# EAGLE design board2 (EAGLE 7.6.0)
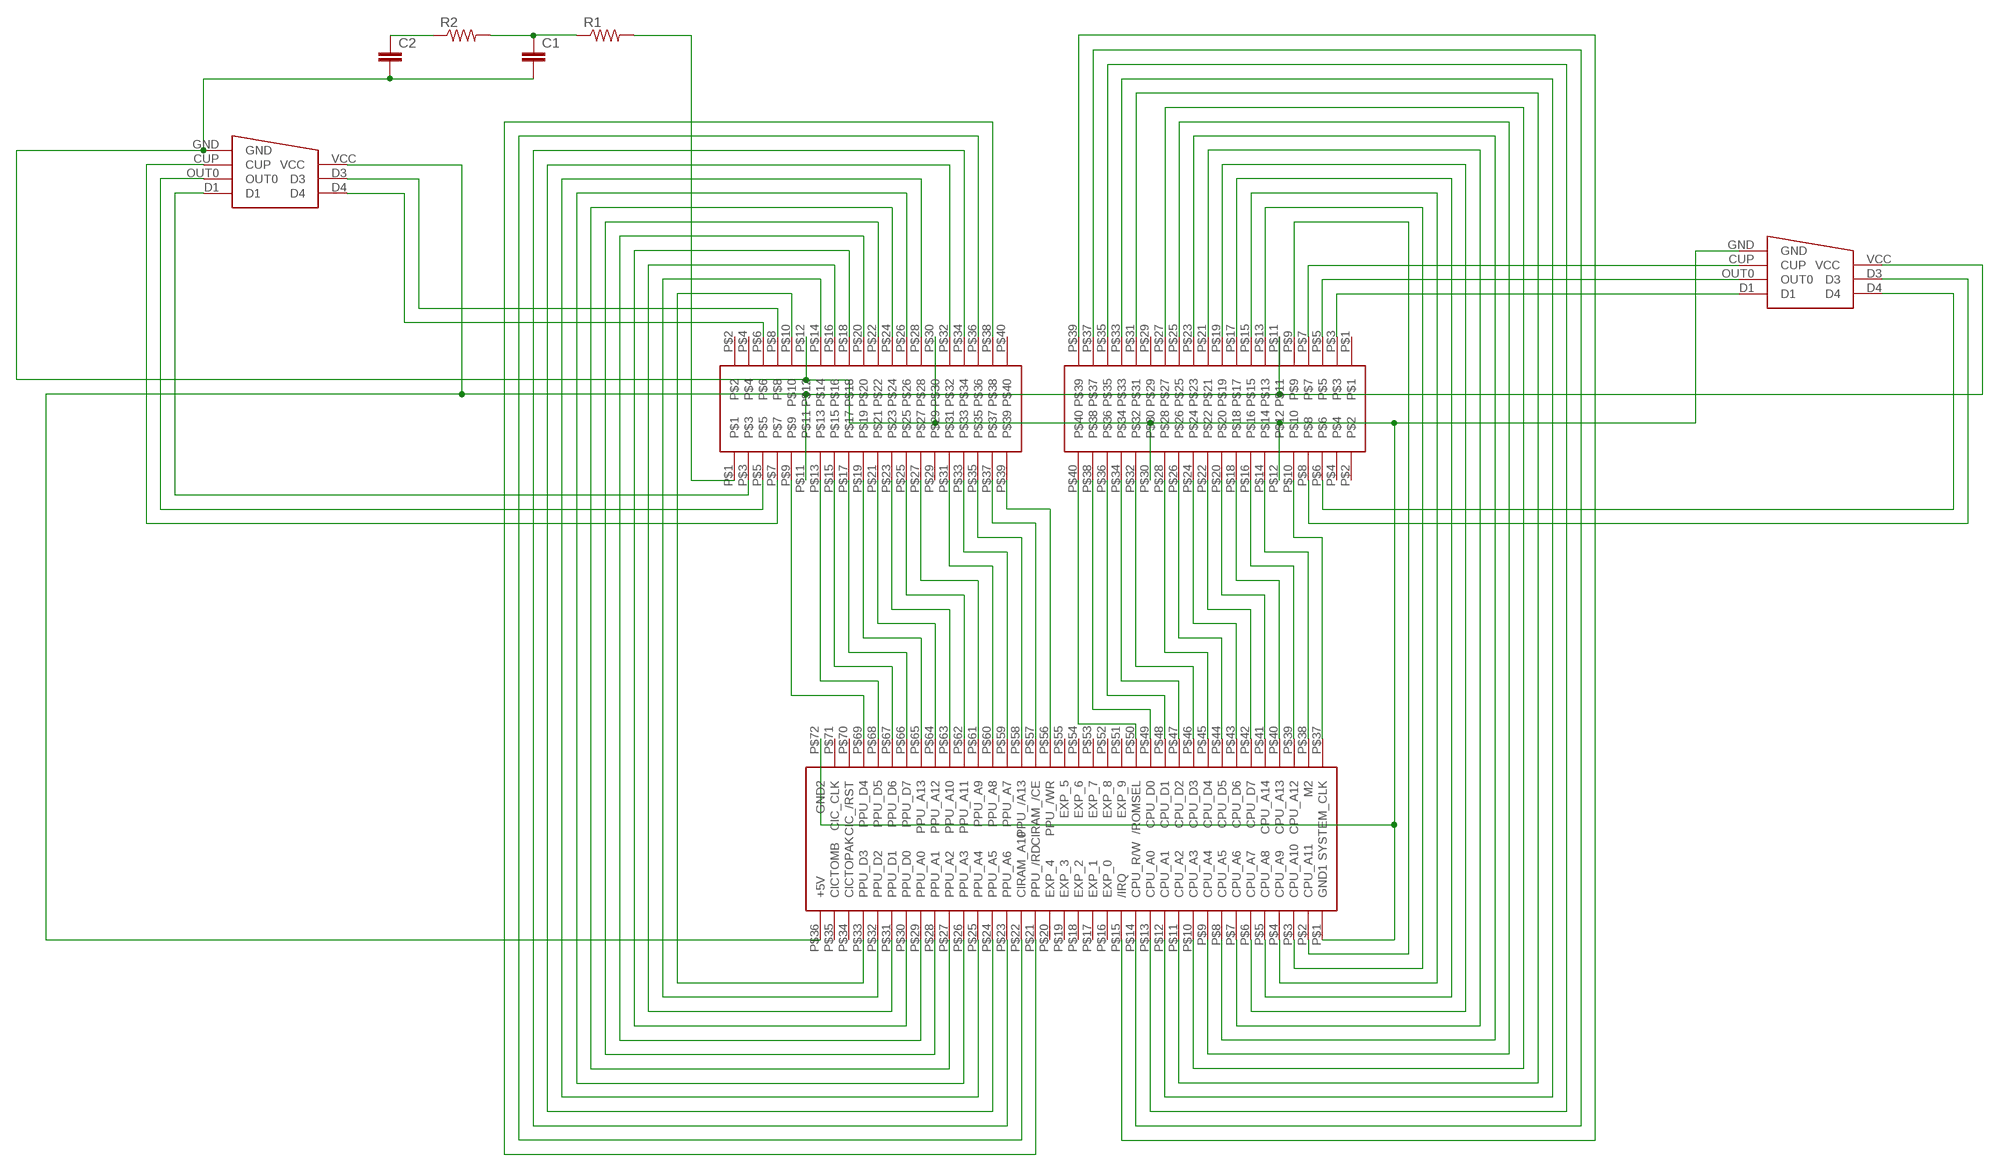
[diagram p0: schematic, sheet 1]

## Parts
C1  C5/2.5  [C5B2.5]
C2  C5/2.5  [C5B2.5]
R1  R-US_0207/12  [0207/12]
R2  R-US_0207/12  [0207/12]
U$1  NES_CONN  [36X2]
U$2  40PINNER  [40PINNER]
U$3  40PINNER  [40PINNER]
U$4  7CONN  [7CON]
U$5  7CONN  [7CON]

## Nets
+5V: U$1.P$36(+5V) U$2.P$11 U$3.P$11 U$4.VCC U$5.VCC
AUD: C2.1 R2.1
GND: C1.2 C2.2 U$1.P$1(GND1) U$1.P$72(GND2) U$2.P$12 U$2.P$30 U$3.P$12 U$3.P$30 U$4.GND U$5.GND
N$1: U$3.P$7 U$4.CUP
N$2: U$1.P$2(CPU_A11) U$3.P$9
N$3: U$1.P$50(/ROMSEL) U$3.P$40
N$4: U$1.P$49(CPU_D0) U$3.P$38
N$5: U$1.P$3(CPU_A10) U$3.P$13
N$6: U$1.P$4(CPU_A9) U$3.P$15
N$7: U$1.P$48(CPU_D1) U$3.P$36
N$8: U$1.P$47(CPU_D2) U$3.P$34
N$9: U$1.P$46(CPU_D3) U$3.P$32
N$10: U$1.P$5(CPU_A8) U$3.P$17
N$11: U$1.P$6(CPU_A7) U$3.P$19
N$12: U$3.P$8 U$4.D3
N$13: U$1.P$45(CPU_D4) U$3.P$28
N$14: U$1.P$44(CPU_D5) U$3.P$26
N$15: U$1.P$43(CPU_D6) U$3.P$24
N$16: U$1.P$42(CPU_D7) U$3.P$22
N$17: U$1.P$41(CPU_A14) U$3.P$20
N$18: U$1.P$40(CPU_A13) U$3.P$18
N$19: U$1.P$39(CPU_A12) U$3.P$16
N$20: U$1.P$38(M2) U$3.P$14
N$21: U$1.P$37(SYSTEM_CLK) U$3.P$10
N$22: U$3.P$5 U$4.OUT0
N$23: U$1.P$7(CPU_A6) U$3.P$21
N$24: U$1.P$8(CPU_A5) U$3.P$23
N$25: U$1.P$9(CPU_A4) U$3.P$25
N$26: U$1.P$10(CPU_A3) U$3.P$27
N$27: U$1.P$11(CPU_A2) U$3.P$31
N$28: U$1.P$12(CPU_A1) U$3.P$33
N$29: U$1.P$13(CPU_A0) U$3.P$35
N$30: U$1.P$14(CPU_R/W) U$3.P$37
N$31: U$1.P$15(/IRQ) U$3.P$39
N$32: U$3.P$6 U$4.D4
N$33: U$1.P$69(PPU_D4) U$2.P$9
N$34: U$1.P$68(PPU_D5) U$2.P$13
N$35: U$1.P$67(PPU_D6) U$2.P$15
N$36: U$1.P$66(PPU_D7) U$2.P$17
N$37: U$1.P$65(PPU_A13) U$2.P$19
N$38: U$1.P$64(PPU_A12) U$2.P$21
N$39: U$1.P$63(PPU_A10) U$2.P$23
N$40: U$1.P$62(PPU_A11) U$2.P$25
N$41: U$1.P$61(PPU_A9) U$2.P$27
N$42: U$1.P$60(PPU_A8) U$2.P$31
N$43: U$1.P$59(PPU_A7) U$2.P$33
N$44: U$1.P$58(PPU_/A13) U$2.P$35
N$45: U$1.P$57(CIRAM_/CE) U$2.P$37
N$46: U$1.P$56(PPU_/WR) U$2.P$39
N$47: U$3.P$3 U$4.D1
N$48: U$2.P$8 U$5.D3
N$49: U$1.P$33(PPU_D3) U$2.P$10
N$50: U$1.P$32(PPU_D2) U$2.P$14
N$51: U$1.P$31(PPU_D1) U$2.P$16
N$52: U$1.P$30(PPU_D0) U$2.P$18
N$53: U$1.P$29(PPU_A0) U$2.P$20
N$54: U$1.P$28(PPU_A1) U$2.P$22
N$55: U$1.P$27(PPU_A2) U$2.P$24
N$56: U$1.P$26(PPU_A3) U$2.P$26
N$57: U$1.P$25(PPU_A4) U$2.P$28
N$58: U$1.P$24(PPU_A5) U$2.P$32
N$59: U$1.P$23(PPU_A6) U$2.P$34
N$60: U$1.P$22(CIRAM_A10) U$2.P$36
N$61: U$1.P$21(PPU_/RD) U$2.P$38
N$62: U$2.P$6 U$5.D4
N$63: U$2.P$7 U$5.CUP
N$64: U$2.P$5 U$5.OUT0
N$65: U$2.P$3 U$5.D1
N$67: C1.1 R1.1 R2.2
N$68: R1.2 U$2.P$1
Unconnected: U$1.P$16(EXP_0) U$1.P$17(EXP_1) U$1.P$18(EXP_2) U$1.P$19(EXP_3) U$1.P$20(EXP_4) U$1.P$34(CICTOPAK) U$1.P$35(CICTOMB) U$1.P$51(EXP_9) U$1.P$52(EXP_8) U$1.P$53(EXP_7) U$1.P$54(EXP_6) U$1.P$55(EXP_5) U$1.P$70(CIC_/RST) U$1.P$71(CIC_CLK) U$2.P$2 U$2.P$4 U$2.P$29 U$2.P$40 U$3.P$1 U$3.P$2 U$3.P$4 U$3.P$29

## Library data of the parts
C1 C2 = capacitor-wima:C: CAPACITOR naming: grid - package width
R1 R2 = rcl:R-US_: RESISTOR, American symbol
U$1 = NES:NES_CONN: NES
U$2 U$3 = NES:40PINNER
U$4 U$5 = NES:7CONN

## Board
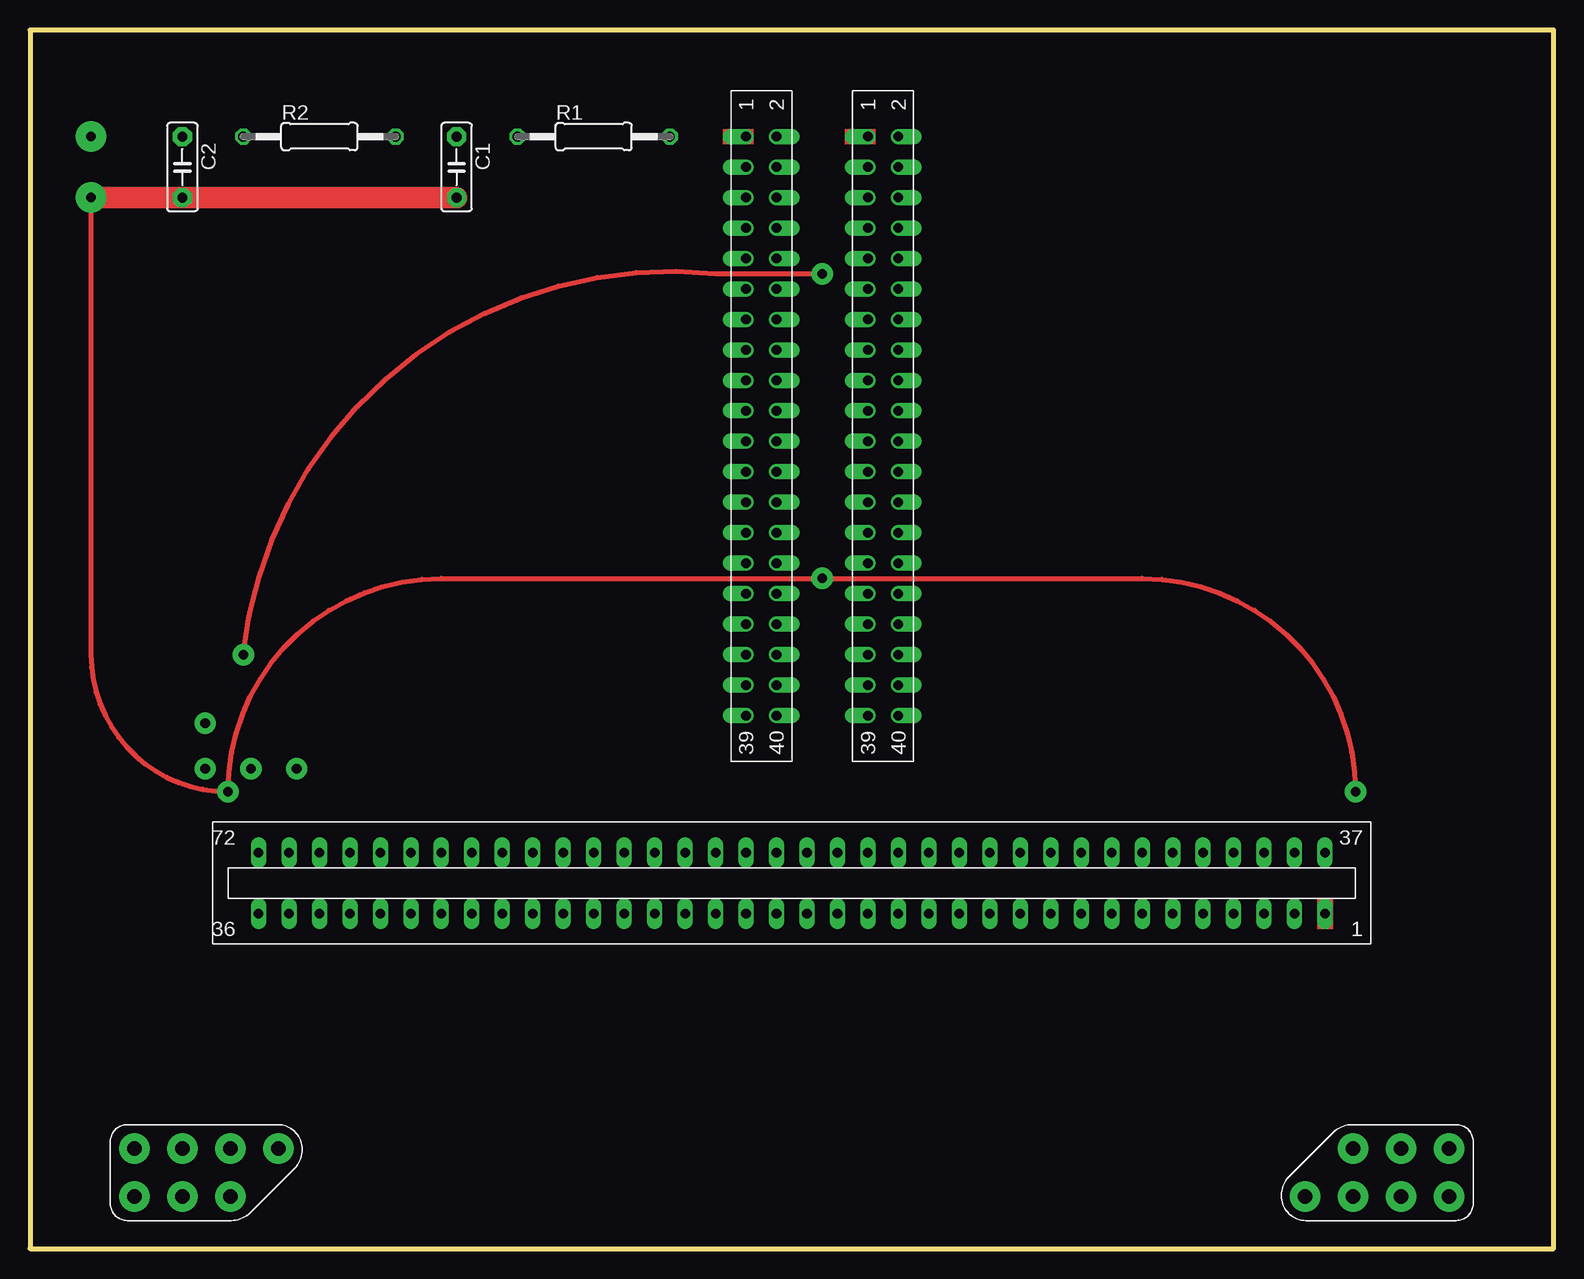
[diagram p1: board, top side]
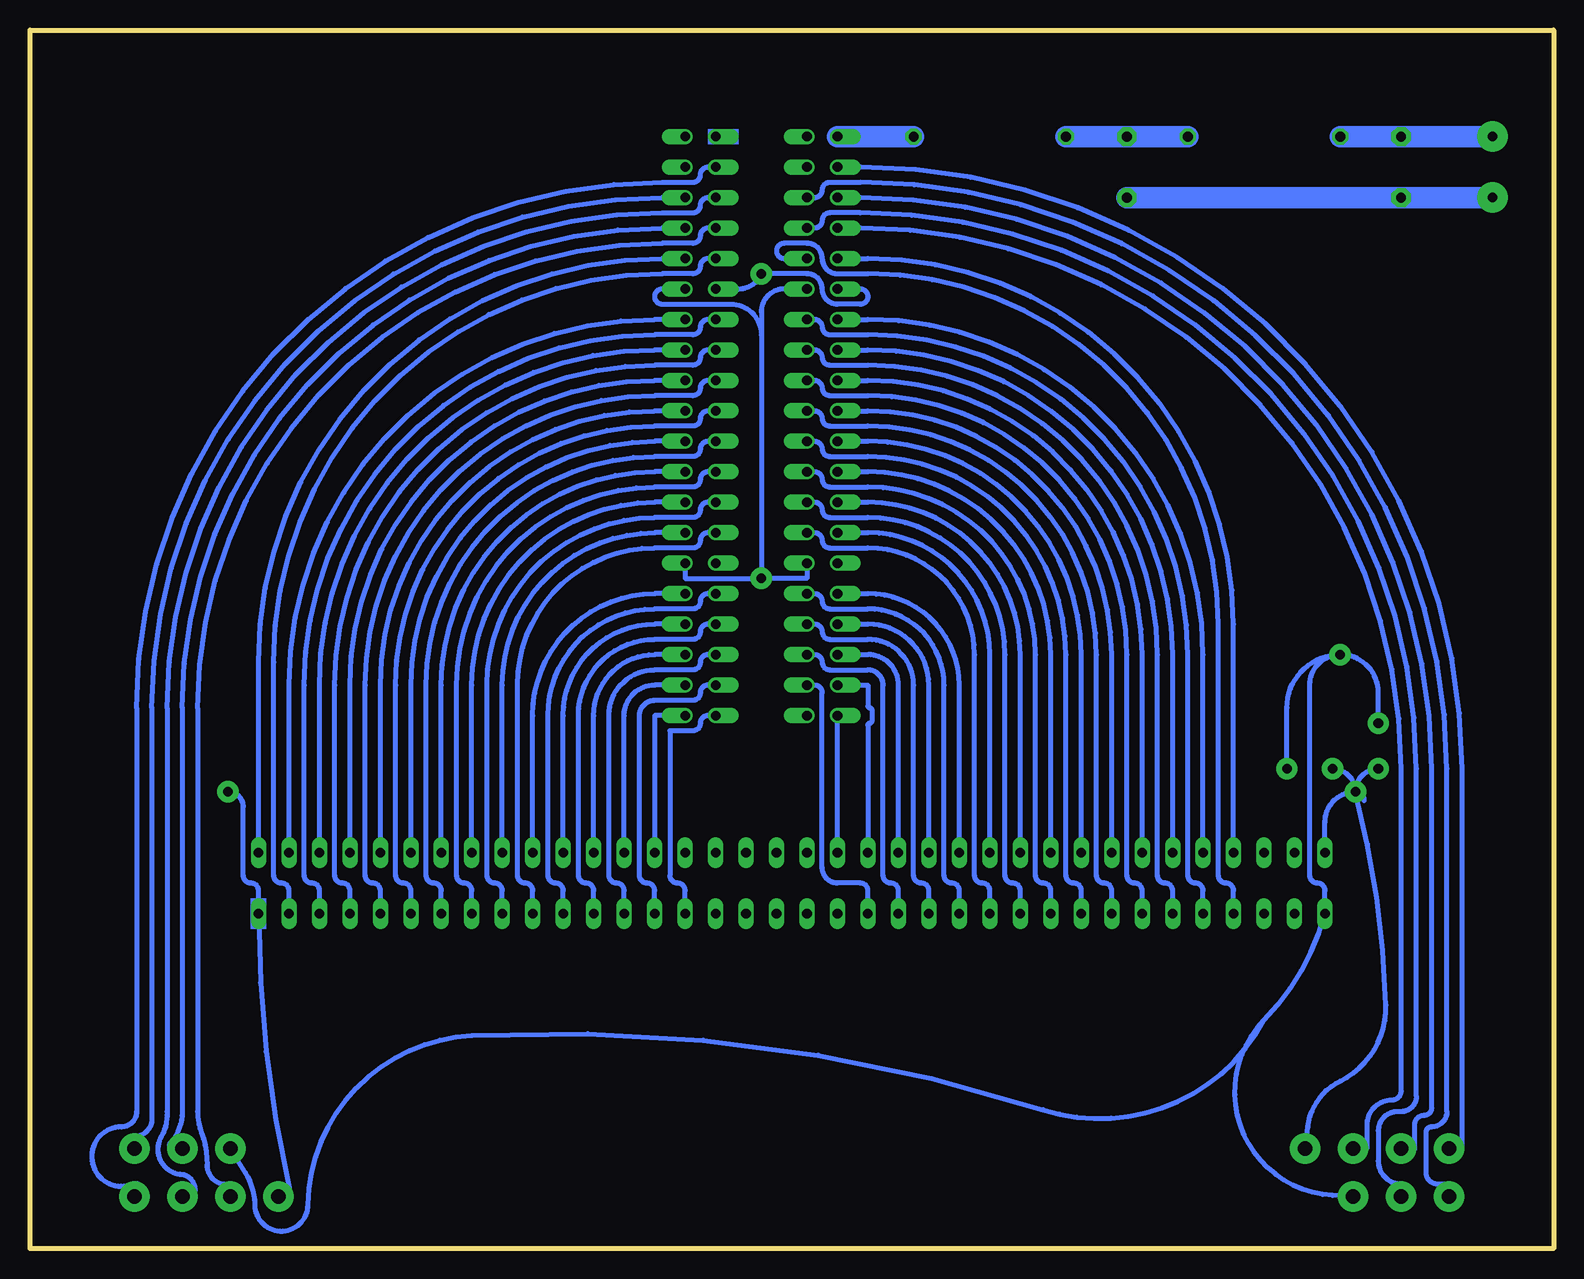
[diagram p2: board, bottom side, seen from below]

Size 127 x 101.6 mm. Coordinates in mm from the lower left corner, seen from the top.
Outline: 0,0 127,0 127,101.6 0,101.6 0,0
Copper layers (1*16): Top 0.035mm / dielectric 1.5mm / Bottom 0.035mm
Design rules "default *": minimum track width 16mil, minimum drill 24mil, track to track 16mil, track to pad 16mil, pad to pad 16mil, via to via 16mil, smd to smd 16mil, copper to edge 40mil, drill to drill 16mil, minimum pad ring 10mil, minimum via ring 8mil, stop-mask expansion 4mil, vias tented up to drill 0mil, thermal gap 10mil

### Footprints (pad centres in the part's own frame; a part is rotated, then mirrored left to right if it is on the bottom)
C5B2.5 = drill 0.813 pad 1.6 octagon: 1 -2.54,0; 2 2.54,0
0207/12 = drill 0.813 octagon: 1 -6.35,0; 2 6.35,0
36X2 = drill 0.8 long: P$1 -44.45,2.54; P$2 -41.91,2.54; P$3 -39.37,2.54; P$4 -36.83,2.54; P$5 -34.29,2.54; P$6 -31.75,2.54; P$7 -29.21,2.54; P$8 -26.67,2.54; P$9 -24.13,2.54; P$10 -21.59,2.54; P$11 -19.05,2.54; P$12 -16.51,2.54; P$13 -13.97,2.54; P$14 -11.43,2.54; P$15 -8.89,2.54; P$16 -6.35,2.54; P$17 -3.81,2.54; P$18 -1.27,2.54; P$19 1.27,2.54; P$20 3.81,2.54; P$21 6.35,2.54; P$22 8.89,2.54; P$23 11.43,2.54; P$24 13.97,2.54; P$25 16.51,2.54; P$26 19.05,2.54; P$27 21.59,2.54; P$28 24.13,2.54; P$29 26.67,2.54; P$30 29.21,2.54; P$31 31.75,2.54; P$32 34.29,2.54; P$33 36.83,2.54; P$34 39.37,2.54; P$35 41.91,2.54; P$36 44.45,2.54; P$37 -44.45,-2.54; P$38 -41.91,-2.54; P$39 -39.37,-2.54; P$40 -36.83,-2.54; P$41 -34.29,-2.54; P$42 -31.75,-2.54; P$43 -29.21,-2.54; P$44 -26.67,-2.54; P$45 -24.13,-2.54; P$46 -21.59,-2.54; P$47 -19.05,-2.54; P$48 -16.51,-2.54; P$49 -13.97,-2.54; P$50 -11.43,-2.54; P$51 -8.89,-2.54; P$52 -6.35,-2.54; P$53 -3.81,-2.54; P$54 -1.27,-2.54; P$55 1.27,-2.54; P$56 3.81,-2.54; P$57 6.35,-2.54; P$58 8.89,-2.54; P$59 11.43,-2.54; P$60 13.97,-2.54; P$61 16.51,-2.54; P$62 19.05,-2.54; P$63 21.59,-2.54; P$64 24.13,-2.54; P$65 26.67,-2.54; P$66 29.21,-2.54; P$67 31.75,-2.54; P$68 34.29,-2.54; P$69 36.83,-2.54; P$70 39.37,-2.54; P$71 41.91,-2.54; P$72 44.45,-2.54
40PINNER = drill 0.8 offset: P$1 -16.51,-1.27; P$2 -16.51,1.27; P$3 -13.97,-1.27; P$4 -13.97,1.27; P$5 -11.43,-1.27; P$6 -11.43,1.27; P$7 -8.89,-1.27; P$8 -8.89,1.27; P$9 -6.35,-1.27; P$10 -6.35,1.27; P$11 -3.81,-1.27; P$12 -3.81,1.27; P$13 -1.27,-1.27; P$14 -1.27,1.27; P$15 1.27,-1.27; P$16 1.27,1.27; P$17 3.81,-1.27; P$18 3.81,1.27; P$19 6.35,-1.27; P$20 6.35,1.27; P$21 8.89,-1.27; P$22 8.89,1.27; P$23 11.43,-1.27; P$24 11.43,1.27; P$25 13.97,-1.27; P$26 13.97,1.27; P$27 16.51,-1.27; P$28 16.51,1.27; P$29 19.05,-1.27; P$30 19.05,1.27; P$31 21.59,-1.27; P$32 21.59,1.27; P$33 24.13,-1.27; P$34 24.13,1.27; P$35 26.67,-1.27; P$36 26.67,1.27; P$37 29.21,-1.27; P$38 29.21,1.27; P$39 31.75,-1.27; P$40 31.75,1.27
7CON = drill 1.2 pad 2.54: CUP -2,4; D1 -2,-4; D3 2,0; D4 2,-4; GND -2,8; OUT0 -2,0; VCC 2,4

### Placement (x,y rotation side)
C1  35.56,90.17 270 top
C2  12.7,90.17 270 top
R1  46.99,92.71 0 top
R2  24.13,92.71 0 top
U$1  63.5,30.48 180 top
U$2  60.96,76.2 270 top
U$3  71.12,76.2 270 top
U$4  114.3,6.35 90 top
U$5  12.7,6.35 270 top

### Tracks (layer width: path | path; a pad name or v marks a point on that pad's centre or on a via)
+5V  (via drill 0.8 pad 1.78)
  Top 0.406: v17.78,49.53 arc-90 57.15,81.28 v66.04,81.28
  Bottom 0.406: U$2.P$11 57.78,80.01 arc180 57.78,78.74 59.69,78.74 arc90 60.96,80.01 arc-90 62.23,81.28 v66.04,81.28 arc67 67.94,80.01 U$3.P$11 | v17.78,49.53 arc-90 20.32,46.99 20.32,31.11 arc-90 19.68,30.48 arc90 19.05,29.84 U$1.P$36 arc29 24.13,19.05 | v14.61,43.81 14.61,46.35 arc-90 v17.78,49.53 | v22.23,40.01 22.23,45.09 arc90 v17.78,49.53 | U$5.VCC 18.41,4.45 arc131 24.13,19.05 | U$4.VCC 109.06,6.35 arc31 108.27,3.65 arc-178 103.82,3.65 arc86 90.17,17.78 arc21 42.55,11.59 arc-80 24.13,19.05
AUD  (via drill 0.8 pad 2.54)
  Bottom 1.778: v5.08,92.71 C2.1 R2.1
GND  (via drill 0.8 pad 1.78, 0.8 pad 2.54)
  Top 0.406: v110.49,38.1 arc90 92.71,55.88 v66.04,55.88 34.29,55.88 arc90 v16.51,38.1 arc-90 5.08,49.53 v5.08,87.63
  Top 1.778: C1.2 C2.2 v5.08,87.63
  Bottom 0.406: U$2.P$30 62.23,55.88 v66.04,55.88 | U$3.P$30 72.39,55.88 v66.04,55.88 | U$2.P$12 64.14,80.01 arc-90 66.04,78.11 66.04,76.2 | 66.04,76.2 v66.04,55.88 | U$3.P$12 74.3,80.01 arc-180 74.3,78.74 68.58,78.74 arc90 66.04,76.2 | v110.49,38.1 arc90 109.22,36.83 109.22,31.11 arc-90 108.58,30.48 arc90 107.95,29.84 U$1.P$1 arc-13 105.41,5.08 arc127 U$4.GND | U$1.P$72 19.05,35.56 arc90 v16.51,38.1 | 15.78,37.37 arc-90 v16.51,38.1 | v16.51,38.1 arc90 v14.61,40.01 | v16.51,38.1 arc-90 v18.41,40.01 | U$5.GND 20.48,10.16 arc57 17.78,13.97 arc-65 13.97,20.32 arc-13 v16.51,38.1
  Bottom 1.778: v5.08,87.63 C2.2 C1.2
N$1
  Bottom 0.406: U$3.P$7 70.48,85.09 arc-90 71.12,84.45 arc90 71.75,83.82 74.3,83.82 arc-90 113.03,45.09 113.03,11.43 arc-21 112.71,9.68 arc21 112.24,6.99 arc-102 110.33,5.4 arc199 U$4.CUP
N$2
  Bottom 0.406: U$1.P$2 105.41,29.84 arc-90 106.05,30.48 arc90 106.68,31.11 106.68,48.9 arc90 74.3,81.28 71.75,81.28 arc-90 71.12,81.92 arc90 70.48,82.55 U$3.P$9
N$3
  Bottom 0.406: U$3.P$40 74.93,44.45 U$1.P$50
N$4
  Bottom 0.406: U$3.P$38 74.93,46.99 arc-90 77.47,44.45 U$1.P$49
N$5
  Bottom 0.406: U$1.P$3 102.87,29.84 arc-90 103.5,30.48 arc90 104.14,31.11 104.14,46.99 arc90 74.93,76.2 71.75,76.2 arc-90 71.12,76.83 arc90 70.48,77.47 U$3.P$13
N$6
  Bottom 0.406: U$1.P$4 100.33,29.84 arc-90 100.97,30.48 arc90 101.6,31.11 101.6,46.99 arc90 74.93,73.66 71.75,73.66 arc-90 71.12,74.3 arc90 70.48,74.93 U$3.P$15
N$7
  Bottom 0.406: U$3.P$36 74.93,49.53 arc-90 80.01,44.45 U$1.P$48
N$8
  Bottom 0.406: U$3.P$34 74.93,52.07 arc-90 82.55,44.45 U$1.P$47
N$9
  Bottom 0.406: U$3.P$32 74.93,54.61 arc-90 85.09,44.45 U$1.P$46
N$10
  Bottom 0.406: U$1.P$5 97.79,29.84 arc-90 98.42,30.48 arc90 99.06,31.11 99.06,46.99 arc90 74.93,71.12 71.75,71.12 arc-90 71.12,71.75 arc90 70.48,72.39 U$3.P$17
N$11
  Bottom 0.406: U$1.P$6 95.25,29.84 arc-90 95.89,30.48 arc90 96.52,31.11 96.52,46.99 arc90 74.93,68.58 71.75,68.58 arc-90 71.12,69.22 arc90 70.48,69.85 U$3.P$19
N$12
  Bottom 0.406: U$3.P$8 74.3,85.09 arc-90 114.3,45.09 114.3,11.43 arc41 115.25,8.89 arc-203 U$4.D3
N$13
  Bottom 0.406: U$3.P$28 74.93,59.69 arc-90 87.63,46.99 U$1.P$45
N$14
  Bottom 0.406: U$3.P$26 74.93,62.23 arc-90 90.17,46.99 U$1.P$44
N$15
  Bottom 0.406: U$3.P$24 74.93,64.77 arc-90 92.71,46.99 U$1.P$43
N$16
  Bottom 0.406: U$3.P$22 74.93,67.31 arc-90 95.25,46.99 U$1.P$42
N$17
  Bottom 0.406: U$3.P$20 74.93,69.85 arc-90 97.79,46.99 U$1.P$41
N$18
  Bottom 0.406: U$3.P$18 74.93,72.39 arc-90 100.33,46.99 U$1.P$40
N$19
  Bottom 0.406: U$3.P$16 74.93,74.93 arc-90 102.87,46.99 U$1.P$39
N$20
  Bottom 0.406: U$3.P$14 74.93,77.47 arc-90 105.41,46.99 U$1.P$38
N$21
  Bottom 0.406: U$3.P$10 74.3,82.55 arc-90 107.95,48.9 U$1.P$37
N$22
  Bottom 0.406: U$3.P$5 70.48,87.63 arc-90 71.12,87 arc90 71.75,86.36 74.3,86.36 arc-90 115.57,45.09 115.57,11.43 arc32 116.05,9.37 arc-119 114.3,6.19 arc103 113.35,4.45 arc138 U$4.OUT0
N$23
  Bottom 0.406: U$1.P$7 92.71,29.84 arc-90 93.34,30.48 arc90 93.98,31.11 93.98,46.99 arc90 74.93,66.04 71.75,66.04 arc-90 71.12,66.67 arc90 70.48,67.31 U$3.P$21
N$24
  Bottom 0.406: U$1.P$8 90.17,29.84 arc-90 90.81,30.48 arc90 91.44,31.11 91.44,46.99 arc90 74.93,63.5 71.75,63.5 arc-90 71.12,64.14 arc90 70.48,64.77 U$3.P$23
N$25
  Bottom 0.406: U$1.P$9 87.63,29.84 arc-90 88.27,30.48 arc90 88.9,31.11 88.9,46.99 arc90 74.93,60.96 71.75,60.96 arc-90 71.12,61.59 arc90 70.48,62.23 U$3.P$25
N$26
  Bottom 0.406: U$1.P$10 85.09,29.84 arc-90 85.72,30.48 arc90 86.36,31.11 86.36,46.99 arc90 74.93,58.42 71.75,58.42 arc-90 71.12,59.05 arc90 70.48,59.69 U$3.P$27
N$27
  Bottom 0.406: U$1.P$11 82.55,29.84 arc-90 83.19,30.48 arc90 83.82,31.11 83.82,44.45 arc90 74.93,53.34 71.75,53.34 arc-90 71.12,53.98 arc90 70.48,54.61 U$3.P$31
N$28
  Bottom 0.406: U$1.P$12 80.01,29.84 arc-90 80.64,30.48 arc90 81.28,31.11 81.28,44.45 arc90 74.93,50.8 71.75,50.8 arc-90 71.12,51.44 arc90 70.48,52.07 U$3.P$33
N$29
  Bottom 0.406: U$1.P$13 77.47,29.84 arc-90 78.11,30.48 arc90 78.74,31.11 78.74,44.45 arc90 74.93,48.26 71.75,48.26 arc-90 71.12,48.9 arc90 70.48,49.53 U$3.P$35
N$30
  Bottom 0.406: U$1.P$14 74.93,29.84 arc-90 75.56,30.48 arc90 76.2,31.11 76.2,44.45 arc90 74.93,45.72 71.75,45.72 arc-90 71.12,46.35 arc90 70.48,46.99 U$3.P$37
N$31
  Bottom 0.406: U$1.P$15 72.39,29.84 arc-90 73.03,30.48 arc90 73.66,31.11 73.66,43.18 71.75,43.18 arc-90 71.12,43.81 arc90 70.48,44.45 U$3.P$39
N$32
  Bottom 0.406: U$3.P$6 74.3,87.63 arc-90 116.84,45.09 116.84,10.79 arc90 118.27,9.37 118.27,8.38 arc90 U$4.D4
N$33
  Bottom 0.406: U$2.P$9 57.15,82.55 arc90 26.67,52.07 U$1.P$69
N$34
  Bottom 0.406: U$2.P$13 57.15,77.47 arc90 29.21,49.53 U$1.P$68
N$35
  Bottom 0.406: U$2.P$15 57.15,74.93 arc90 31.75,49.53 U$1.P$67
N$36
  Bottom 0.406: U$2.P$17 57.15,72.39 arc90 34.29,49.53 U$1.P$66
N$37
  Bottom 0.406: U$2.P$19 57.15,69.85 arc90 36.83,49.53 U$1.P$65
N$38
  Bottom 0.406: U$2.P$21 57.15,67.31 arc90 39.37,49.53 U$1.P$64
N$39
  Bottom 0.406: U$2.P$23 57.15,64.77 arc90 41.91,49.53 U$1.P$63
N$40
  Bottom 0.406: U$2.P$25 57.15,62.23 arc90 44.45,49.53 U$1.P$62
N$41
  Bottom 0.406: U$2.P$27 57.15,59.69 arc90 46.99,49.53 U$1.P$61
N$42
  Bottom 0.406: U$2.P$31 57.15,54.61 arc90 49.53,46.99 U$1.P$60
N$43
  Bottom 0.406: U$2.P$33 57.15,52.07 arc90 52.07,46.99 U$1.P$59
N$44
  Bottom 0.406: U$2.P$35 57.15,49.53 arc90 54.61,46.99 U$1.P$58
N$45
  Bottom 0.406: U$2.P$37 57.15,46.99 57.15,45.24 arc-90 56.99,45.09 arc90 56.83,44.93 56.83,43.97 arc90 56.99,43.81 arc-90 57.15,43.66 U$1.P$57
N$46
  Bottom 0.406: U$1.P$56 U$2.P$39
N$47
  Bottom 0.406: U$3.P$3 70.48,90.17 arc-90 71.12,89.53 arc90 71.75,88.9 74.3,88.9 arc-90 118.11,45.09 118.11,11.43 arc90 119.38,10.16 arc-203 118.43,5.4 arc211 U$4.D1
N$48
  Bottom 0.406: U$2.P$8 61.59,85.09 arc-90 60.96,85.72 arc90 60.33,86.36 57.78,86.36 arc90 11.43,40.01 11.43,12.7 arc90 12.7,11.43 13.02,11.43 arc-90 14.61,9.84 14.61,7.3 arc-90 12.7,5.4 U$5.D3
N$49
  Bottom 0.406: U$1.P$33 26.67,29.84 arc-90 27.3,30.48 arc90 27.94,31.11 27.94,52.07 arc-90 57.15,81.28 59.69,81.28 arc90 60.96,82.55 arc-90 62.23,83.82 64.14,83.82 arc-180 64.14,82.55 U$2.P$10
N$50
  Bottom 0.406: U$2.P$14 61.59,77.47 arc90 60.96,76.83 arc-90 60.33,76.2 57.15,76.2 arc90 30.48,49.53 30.48,31.11 arc-90 29.84,30.48 arc90 29.21,29.84 U$1.P$32
N$51
  Bottom 0.406: U$2.P$16 61.59,74.93 arc90 60.96,74.3 arc-90 60.33,73.66 57.15,73.66 arc90 33.02,49.53 33.02,31.11 arc-90 32.38,30.48 arc90 31.75,29.84 U$1.P$31
N$52
  Bottom 0.406: U$2.P$18 61.59,72.39 arc90 60.96,71.75 arc-90 60.33,71.12 57.15,71.12 arc90 35.56,49.53 35.56,31.11 arc-90 34.92,30.48 arc90 34.29,29.84 U$1.P$30
N$53
  Bottom 0.406: U$2.P$20 61.59,69.85 arc90 60.96,69.22 arc-90 60.33,68.58 57.15,68.58 arc90 38.1,49.53 38.1,31.11 arc-90 37.47,30.48 arc90 36.83,29.84 U$1.P$29
N$54
  Bottom 0.406: U$2.P$22 61.59,67.31 arc90 60.96,66.67 arc-90 60.33,66.04 57.15,66.04 arc90 40.64,49.53 40.64,31.11 arc-90 40.01,30.48 arc90 39.37,29.84 U$1.P$28
N$55
  Bottom 0.406: U$2.P$24 61.59,64.77 arc90 60.96,64.14 arc-90 60.33,63.5 57.15,63.5 arc90 43.18,49.53 43.18,31.11 arc-90 42.55,30.48 arc90 41.91,29.84 U$1.P$27
N$56
  Bottom 0.406: U$2.P$26 61.59,62.23 arc90 60.96,61.59 arc-90 60.33,60.96 57.15,60.96 arc90 45.72,49.53 45.72,31.11 arc-90 45.09,30.48 arc90 44.45,29.84 U$1.P$26
N$57
  Bottom 0.406: U$2.P$28 61.59,59.69 arc90 60.96,59.05 arc-90 60.33,58.42 57.15,58.42 arc90 48.26,49.53 48.26,31.11 arc-90 47.62,30.48 arc90 46.99,29.84 U$1.P$25
N$58
  Bottom 0.406: U$2.P$32 61.59,54.61 arc90 60.96,53.98 arc-90 60.33,53.34 57.15,53.34 arc90 50.8,46.99 50.8,31.11 arc-90 50.16,30.48 arc90 49.53,29.84 U$1.P$24
N$59
  Bottom 0.406: U$2.P$34 61.59,52.07 arc90 60.96,51.44 arc-90 60.33,50.8 57.15,50.8 arc90 53.34,46.99 53.34,31.11 arc-90 52.7,30.48 arc90 52.07,29.84 U$1.P$23
N$60
  Bottom 0.406: U$2.P$36 61.59,49.53 arc90 60.96,48.9 arc-90 60.33,48.26 57.15,48.26 arc90 55.88,46.99 55.88,31.11 arc-90 55.24,30.48 arc90 54.61,29.84 U$1.P$22
N$61
  Bottom 0.406: U$2.P$38 61.59,46.99 arc90 60.96,46.35 60.96,31.75 arc-90 59.69,30.48 57.78,30.48 arc90 57.15,29.84 U$1.P$21
N$62
  Bottom 0.406: U$2.P$6 61.59,87.63 arc-90 60.96,88.27 arc90 60.33,88.9 57.78,88.9 arc90 8.89,40.01 8.89,11.43 arc90 10.16,10.16 arc-90 10.64,9.68 10.64,6.35 arc-90 9.68,5.4 8.57,5.4 arc-90 8.7,5.27 U$5.D4
N$63
  Bottom 0.406: U$2.P$7 57.78,85.09 arc90 12.7,40.01 12.7,13.18 arc90 13.49,12.38 arc-90 15.56,10.32 15.56,8.41 arc90 15.62,8.35 U$5.CUP
N$64
  Bottom 0.406: U$2.P$5 57.78,87.63 arc90 10.16,40.01 10.16,11.75 arc90 10.79,11.11 arc-90 11.59,10.32 11.59,8.26 arc-90 11.68,8.35 U$5.OUT0
N$65
  Bottom 0.406: U$2.P$3 57.78,90.17 arc90 7.62,40.01 7.62,8.41 8.7,8.41 U$5.D1
N$67
  Bottom 1.778: R2.2 C1.1 R1.1
N$68
  Bottom 1.778: R1.2 U$2.P$1